# EasyEDA Pro project FSS1500-HAND-V2.eprj

# Schematic Schematic1
Create Date: 2022-12-30; Page Name: P1; Project Name: FSS1500-HAND; Schematic Name: Schematic1; Update Date: 2023-02-28
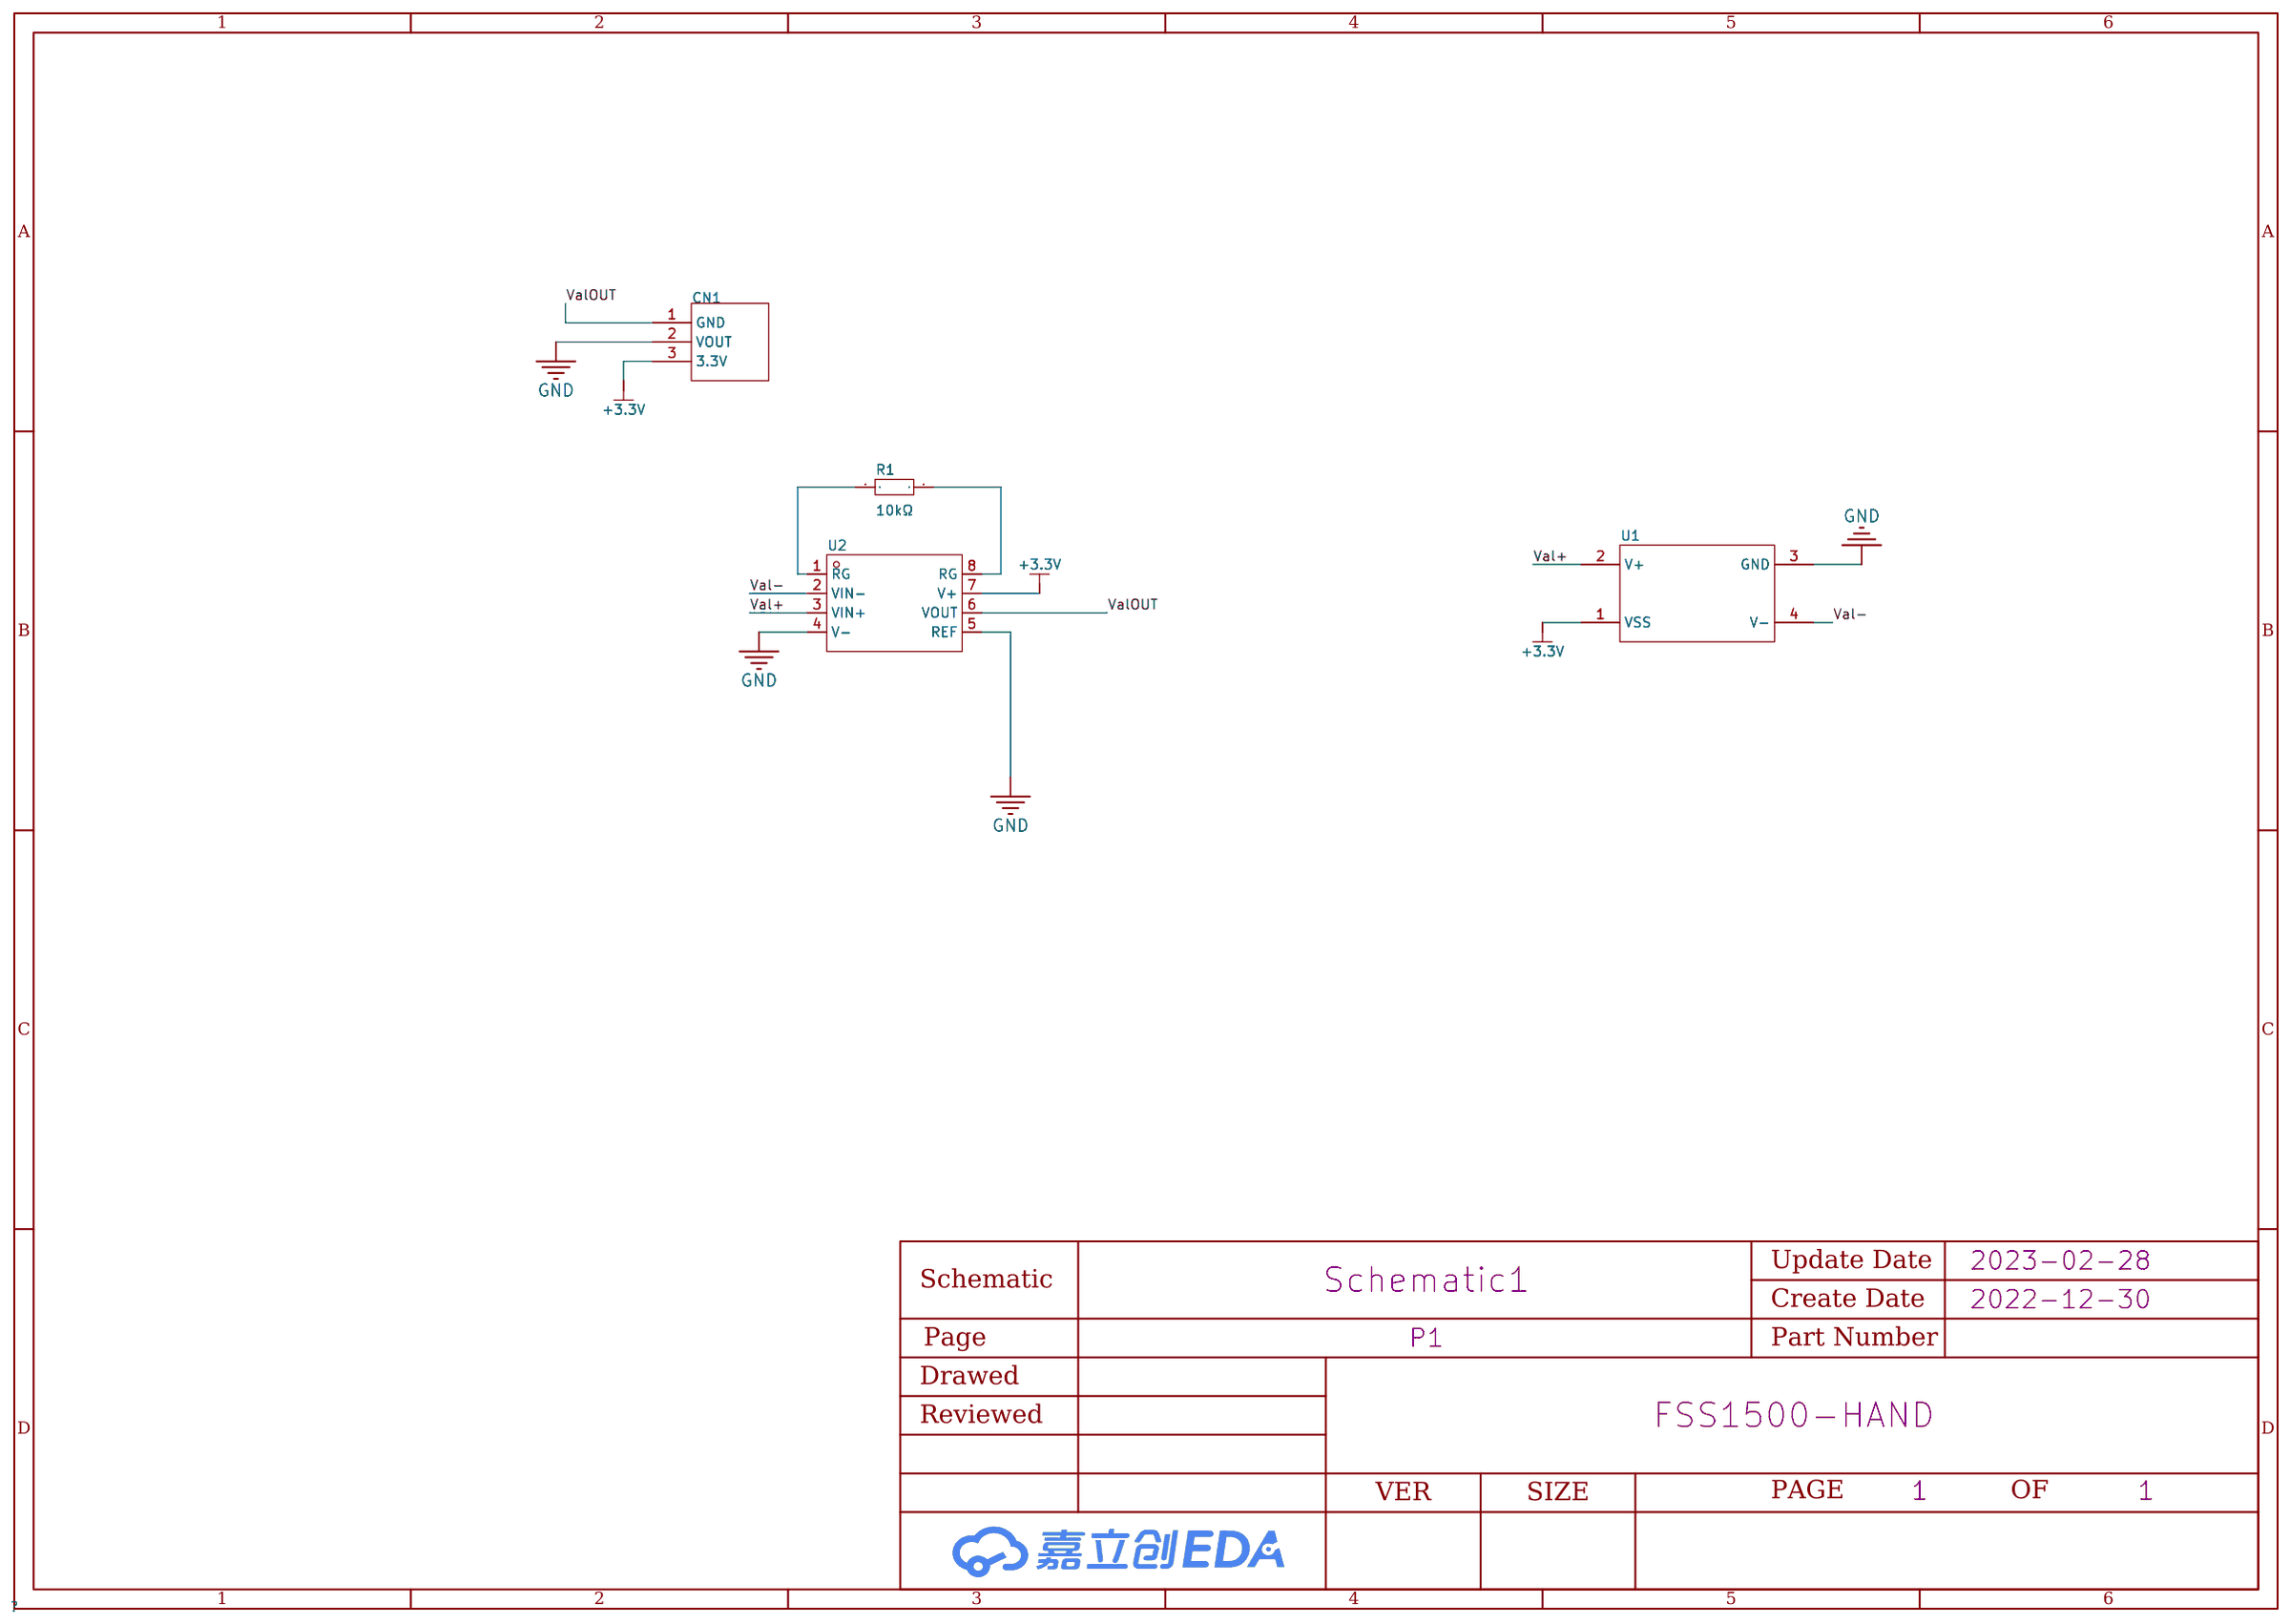
[diagram p0: schematic sheet]

## Parts
CN1  -  [3POINT]
R1  10kΩ  [R0603]
U1  -  [FSS1500NST]
U2  INA333AIDGKR  [MSOP-8_L3.0-W3.0-P0.65-LS5.0-BL]

## Library data of the parts
CN1 = 3POINT
R1 = CR0603JA0103G: 电阻类型:厚膜电阻;阻值:10kΩ;精度:±5%;功率:1/10W;温度系数:±200ppm/;最大工作电压:50V;工作温度范围:-55~+125;; LCSC Part Name: 10kΩ ±5%; Supplier Part: C101254; Manufacturer: LIZ(丽智电子); Supplier Footprint: 0603; JLCPCB Part Class: Extended Part; Datasheet: https://atta.szlcsc.com/upload/public/pdf/source/20170408/1491631441449.pdf; Supplier: LCSC; Type: 厚膜电阻; Tolerance: ±5%; Power(Watts): 1/10W; Temperature Coefficient: ±200ppm/; Overload Voltage (Max): 50V; Operating Temperature Range: -55~+125
U1 = FSS1500
U2 = INA333AIDGKR: 运放类型:Instrumentation;放大器组数:1;增益带宽积（GBP）:-;压摆率（SR）:0.16 V/us;电源电压:1.8V ~ 5.5V, ±0.9V ~ 2.75V;各通道供电电流:75uA;; Supplier Part: C19450; Manufacturer: TI(德州仪器); Supplier Footprint: VSSOP-8; JLCPCB Part Class: Extended Part; Datasheet: https://atta.szlcsc.com/upload/public/pdf/source/20130925/1457706651096.pdf; Supplier: LCSC; Amplifier Type: Instrumentation; Number of Circuits: 1; Slew Rate（SR）: 0.16 V/us; Output Type: Rail-to-Rail; Supply Voltage（Single）: 1.8V ~ 5.5V, ±0.9V ~ 2.75V; Iq per channel (Typ): 75uA; Operating Temperature: -40°C ~ 125°C

## Nets
+3.3V: CN1.3(3.3V) U1.1(VSS) U2.7(V+)
GND: CN1.2(VOUT) U1.3(GND) U2.4(V-) U2.5(REF)
Val+: U1.2(V+) U2.3(VIN+)
Val-: U1.4(V-) U2.2(VIN-)
ValOUT: CN1.1(GND) U2.6(VOUT)
$1N427: R1.1 U2.1(RG)
$1N434: R1.2 U2.8(RG)

# Board PCB1
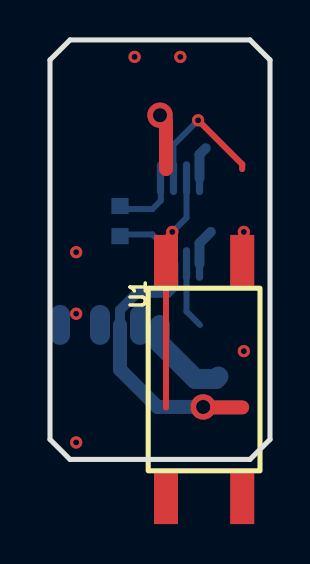
[diagram p1: board, top side]
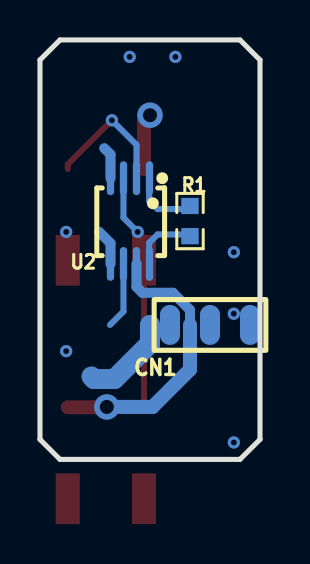
[diagram p2: board, bottom side, seen from below]

Outline 11 x 21 mm; copper layers: Top Layer, Bottom Layer. Coordinates in mm from the lower left corner of the outline.
Outline path: 0,20 0,1 1,0 10,0 11,1 11,20 10,21 1,21 0,20
Stack: Top Layer 0.035mm / Dielectric1 1.51mm FR4 er 4.5 / Bottom Layer 0.035mm

## Design rules (mm)
spacing safeClearance (default): track to track 0.152, other pairs 0.152 to 0.3
track width trackWidth (default): min 0.127, default 0.254, max 2.54
differential pair differentialPair (default): width min 0.127, default 0.254, max 2.54; gap min 0.152, default 0.152
via viaSize (default): diameter min 0.5, default 0.61, max 10; hole min 0.3, default 0.305, max 6

## Placement (name value [footprint] x y rotation side)
CN1  -  [3POINT]  5.5 6.73 180 bottom
R1  10kΩ  [R0603]  3.5 11.93 270 bottom
U1  -  [FSS1500NST]  7.71 4 90 top
U2  INA333AIDGKR  [MSOP-8_L3.0-W3.0-P0.65-LS5.0-BL]  6.5 11.93 0 bottom

## Footprints (pads in the part's own frame, mm; a bottom-side part is the same pattern mirrored in y, then rotated)
3POINT
  oval 1x2 smd: 1(1,0) 2(3,0) 3(5,0)
FSS1500NST
  rect 2.54x1.2 smd: 1(-5.967,-1.905) 2(-5.967,1.905) 3(5.967,1.905) 4(5.967,-1.905)
MSOP-8_L3.0-W3.0-P0.65-LS5.0-BL
  oval 0.363x1.692 smd: 1(-0.976,-2.147) 2(-0.325,-2.147) 3(0.325,-2.147) 4(0.976,-2.147) 5(0.976,2.147) 6(0.325,2.147) 7(-0.325,2.147) 8(-0.976,2.147)
R0603
  rect 0.807x0.864 smd: 1(-0.754,0) 2(0.754,0)

## Nets
+3.3V: CN1.3 U1.1 U2.7
GND: CN1.2 U1.3 U2.4 U2.5
VAL+: U1.2 U2.3
VAL-: U1.4 U2.2
VALOUT: CN1.1 U2.6
$1N427: R1.1 U2.1
$1N434: R1.2 U2.8

## Via types
v1: diameter 0.61, hole 0.305, Top Layer to Bottom Layer, 9 vias
v2: diameter 1.27, hole 0.711, Top Layer to Bottom Layer, 2 vias

## Routing (per net, layer and track width the routed paths; a pad name or vN(x,y) marks a point on that pad's centre or on a via; arc(x,y) is an arc through that point)
+3.3V: length 14.2
  Top Layer w0.7: v2(7.66,2.63) 7.68,2.6 9.61,2.6
  Bottom Layer w0.5: 3.5,6.73 3.5,7.48 4.36,8.34 5.88,8.34 6.18,8.64 U2.7
  Bottom Layer w0.7: 3.5,6.73 3.5,4.5 5.37,2.63 v2(7.66,2.63)
GND: length 10.9
  Top Layer w0.7: 5.8,14.54 5.8,16.93 v2(5.5,17.23)
  Bottom Layer w0.5: 7.79,15.58 7.48,15.27 U2.4 ; U2.5 7.48,10.82 8.04,11.39
  Bottom Layer w1: 5.5,6.73 5.5,5.8 7.28,4.02 8.29,4.02 8.42,4.15
  vias: v1(1.31,10.37) v1(1.31,7.29) v1(1.31,0.85) v1(4.23,20.15) v1(6.52,20.15) v1(9.69,11.39) v1(9.69,5.42)
VAL+: length 11.9
  Top Layer w0.3: v1(6.12,11.39) 5.8,11.07 5.8,2.6
  Bottom Layer w0.3: U2.3 6.82,12.1 v1(6.12,11.39)
VAL-: length 6.8
  Top Layer w0.3: 9.61,14.54 9.61,14.77 v1(7.41,16.98)
  Bottom Layer w0.3: U2.2 6.18,15.75 v1(7.41,16.98)
VALOUT: length 3.3
  Bottom Layer w0.3: U2.6 6.82,7.41 7.5,6.73
$1N427: length 3.3
  Bottom Layer w0.3: 3.52,12.65 3.63,12.53 5.12,12.53 5.54,12.95 5.54,14.04
$1N434: length 3.3
  Bottom Layer w0.3: 3.52,11.14 3.64,11.26 5.12,11.26 5.54,10.84 5.54,9.75
